# Altium schematic sheet main.schdoc
size A2; Organization: Protel International P/L; Address1: L3, 12a Rodborough Rd; Address2: Frenchs Forest; Address3: NSW; Address4: Australia 2086
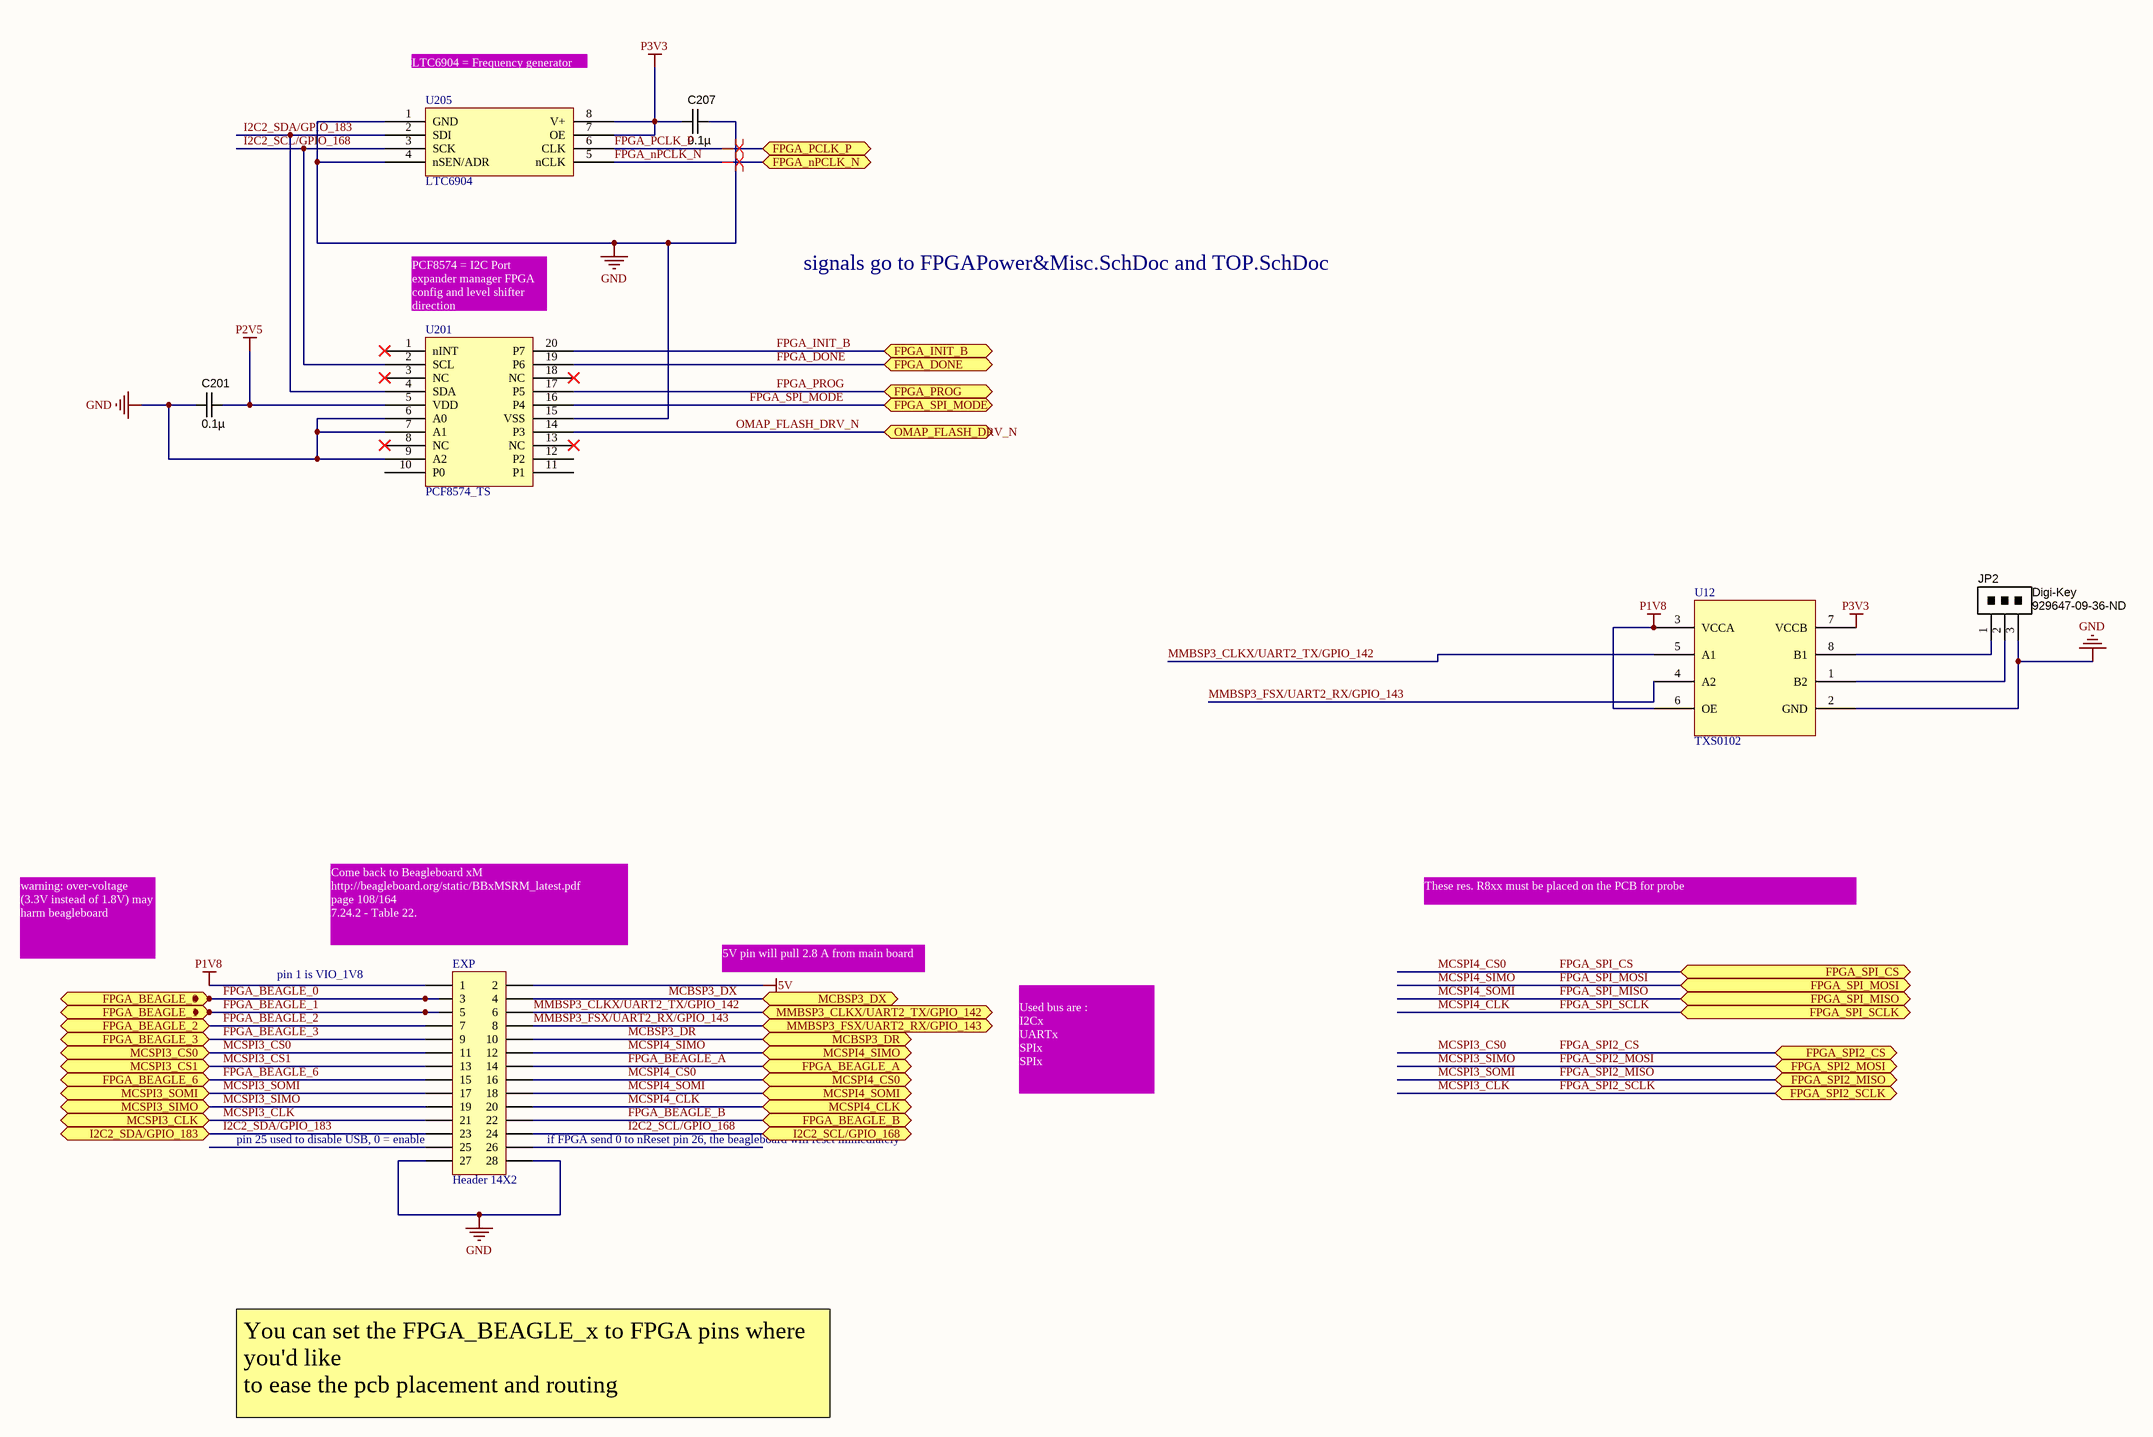
[diagram p0: main.schdoc]

## Parts
C201  0.1µ  [CAPC1005X55N]
C207  0.1µ  [CAPC1005X55N]
EXP  Header 14X2  [HDR2X14]
JP2  Supplier 1: Digi-Key  Supplier Part Number 1: 929647-09-36-ND  [1x3POS_HEADER]  (hidden comment: R T G)
U12  TXS0102  [TSSOP65P400X110-8N]
U201  PCF8574_TS  [TSSOP65P640X120-20N]
U205  LTC6904  [SOP65P490X109-8N]

## Ports
FPGA_BEAGLE_0 (bidir), FPGA_BEAGLE_1 (bidir), FPGA_BEAGLE_2 (bidir), FPGA_BEAGLE_3 (bidir), FPGA_BEAGLE_6 (bidir), FPGA_BEAGLE_A (bidir), FPGA_BEAGLE_B (bidir), FPGA_DONE (bidir), FPGA_INIT_B (bidir), FPGA_nPCLK_N (bidir), FPGA_PCLK_P (bidir), FPGA_PROG (bidir), FPGA_SPI2_CS (bidir), FPGA_SPI2_MISO (bidir), FPGA_SPI2_MOSI (bidir), FPGA_SPI2_SCLK (bidir), FPGA_SPI_CS (bidir), FPGA_SPI_MISO (bidir), FPGA_SPI_MODE (bidir), FPGA_SPI_MOSI (bidir), FPGA_SPI_SCLK (bidir), I2C2_SCL/GPIO_168 (bidir), I2C2_SDA/GPIO_183 (bidir), MCBSP3_DR (bidir), MCBSP3_DX (bidir), MCSPI3_CLK (bidir), MCSPI3_CS0 (bidir), MCSPI3_CS1 (bidir), MCSPI3_SIMO (bidir), MCSPI3_SOMI (bidir), MCSPI4_CLK (bidir), MCSPI4_CS0 (bidir), MCSPI4_SIMO (bidir), MCSPI4_SOMI (bidir), MMBSP3_CLKX/UART2_TX/GPIO_142 (bidir), MMBSP3_FSX/UART2_RX/GPIO_143 (bidir), OMAP_FLASH_DRV_N (bidir)

## Nets
5V: EXP.2
GND: C201.2 C207.1 EXP.27 EXP.28 JP2.3 U12.2(GND) U201.6(A0) U201.7(A1) U201.9(A2) U201.15(VSS) U205.1(GND) U205.4(nSEN/ADR)
P1V8: EXP.1 U12.3(VCCA) U12.6(OE)
P2V5: C201.1 U201.5(VDD)
P3V3: C207.2 U12.7(VCCB) U205.7(OE) U205.8(V+)
FPGA_BEAGLE_0: EXP.3 ; port FPGA_BEAGLE_0
FPGA_BEAGLE_1: EXP.5 ; port FPGA_BEAGLE_1
FPGA_BEAGLE_2: EXP.7 ; port FPGA_BEAGLE_2
FPGA_BEAGLE_3: EXP.9 ; port FPGA_BEAGLE_3
FPGA_BEAGLE_6: EXP.15 ; port FPGA_BEAGLE_6
FPGA_BEAGLE_A: EXP.14 ; port FPGA_BEAGLE_A
FPGA_BEAGLE_B: EXP.22 ; port FPGA_BEAGLE_B
FPGA_DONE: U201.19(P6) ; port FPGA_DONE
FPGA_INIT_B: U201.20(P7) ; port FPGA_INIT_B
FPGA_nPCLK_N: U205.5(nCLK) ; port FPGA_nPCLK_N
FPGA_PCLK_P: U205.6(CLK) ; port FPGA_PCLK_P
FPGA_PROG: U201.17(P5) ; port FPGA_PROG
FPGA_SPI2_CS: EXP.11 ; port MCSPI3_CS0, port FPGA_SPI2_CS  [also labelled MCSPI3_CS0]
FPGA_SPI2_MISO: EXP.17 ; port MCSPI3_SOMI, port FPGA_SPI2_MISO  [also labelled MCSPI3_SOMI]
FPGA_SPI2_MOSI: EXP.19 ; port MCSPI3_SIMO, port FPGA_SPI2_MOSI  [also labelled MCSPI3_SIMO]
FPGA_SPI2_SCLK: EXP.21 ; port MCSPI3_CLK, port FPGA_SPI2_SCLK  [also labelled MCSPI3_CLK]
FPGA_SPI_CS: EXP.16 ; port MCSPI4_CS0, port FPGA_SPI_CS  [also labelled MCSPI4_CS0]
FPGA_SPI_MISO: EXP.18 ; port MCSPI4_SOMI, port FPGA_SPI_MISO  [also labelled MCSPI4_SOMI]
FPGA_SPI_MODE: U201.16(P4) ; port FPGA_SPI_MODE
FPGA_SPI_MOSI: EXP.12 ; port MCSPI4_SIMO, port FPGA_SPI_MOSI  [also labelled MCSPI4_SIMO]
FPGA_SPI_SCLK: EXP.20 ; port MCSPI4_CLK, port FPGA_SPI_SCLK  [also labelled MCSPI4_CLK]
I2C2_SCL/GPIO_168: EXP.24 U201.2(SCL) U205.3(SCK) ; port I2C2_SCL/GPIO_168
I2C2_SDA/GPIO_183: EXP.23 U201.4(SDA) U205.2(SDI) ; port I2C2_SDA/GPIO_183
MCBSP3_DR: EXP.10 ; port MCBSP3_DR
MCBSP3_DX: EXP.4 ; port MCBSP3_DX
MCSPI3_CS1: EXP.13 ; port MCSPI3_CS1
MMBSP3_CLKX/UART2_TX/GPIO_142: EXP.6 U12.5(A1) ; port MMBSP3_CLKX/UART2_TX/GPIO_142
MMBSP3_FSX/UART2_RX/GPIO_143: EXP.8 U12.4(A2) ; port MMBSP3_FSX/UART2_RX/GPIO_143
OMAP_FLASH_DRV_N: U201.14(P3) ; port OMAP_FLASH_DRV_N
NetJP2_1: JP2.1 U12.8(B1)
NetJP2_2: JP2.2 U12.1(B2)

Not connected (* = marked no-connect by the designer): EXP 25 26; U201 1(nINT)* 3(NC)* 8(NC)* 10(P0) 11(P1) 12(P2) 13(NC)* 18(NC)*

## Layout directives
differential pair: FPGA_nPCLK_N, FPGA_PCLK_P

## Notes on the sheet
- LTC6904 = Frequency generator
- (near U201) PCF8574 = I2C Port expander manager FPGA config and level shifter direction
- signals go to FPGAPower&Misc.SchDoc and TOP.SchDoc
- These res. R8xx must be placed on the PCB for probe
- warning: over-voltage (3.3V instead of 1.8V) may harm beagleboard
- pin 1 is VIO_1V8
- (near EXP) Come back to Beagleboard xM
  http://beagleboard.org/static/BBxMSRM_latest.pdf
  page 108/164
  7.24.2 - Table 22.
- 5V pin will pull 2.8 A from main board
- Used bus are :
  I2Cx
  UARTx
  SPIx
  SPIx
- (near EXP) pin 25 used to disable USB, 0 = enable
- (near EXP) if FPGA send 0 to nReset pin 26, the beagleboard will reset immediately
- You can set the FPGA_BEAGLE_x to FPGA pins where you'd like
  to ease the pcb placement and routing
- Title
- Size:
- Date:
- File:
- A1
- Number:
- Time:
- Revision:
- Sheet
- of

## Library data of the parts
C201 C207 = CAPC_1u_0402_X5R_6V3_10%: Capacitor SMD Cer 1uF 10% 16V X5R 0402; Manufacturer 1: AVX Corporation; Manufacturer Part Number 1: 04026D105KAT2A; Ratings: 6.3V; X5R; SCDType: spec; Tolerance: ±10%; Operating Temperature: -55°C ~ 125°C; Package / Case: 0402 (1005 Metric); Size / Dimension: 0.039" L x 0.020" W (1.00mm x 0.50mm); Supplier 1: Digi-Key; Supplier Part Number 1: 478-2583-1-ND; RoHS 1: RoHS Compliant; ComponentLink1URL: http://www.avx.com/docs/Catalogs/cx5r.pdf; ComponentLink1Description: http://www.avx.com/docs/Catalogs/cx5r.pdf; Supplier 2: Digi-Key; Supplier Part Number 2: 311-1438-1-ND; Manufacturer 2: Yageo; Manufacturer Part Number 2: CC0402KRX5R5BB105; RoHS 2: RoHS Compliant; ComponentLink2URL: http://www.yageo.com/documents/recent/UPY-GPHC_X5R_4V-to-50V_12.pdf; ComponentLink2Description: http://www.yageo.com/documents/recent/UPY-GPHC_X5R_4V-to-50V_12.pdf; Supplier 3: Digi-Key; Supplier Part Number 3: 1276-1010-1-ND; Manufacturer 3: Samsung Electro-Mechanics America, Inc; Manufacturer Part Number 3: CL05A105KQ5NNNC; RoHS 3: RoHS Compliant; ComponentLink3URL: http://www.samsungsem.com/servlet/FileDownload?path=productsearch&sname=CL05A105KQ5NNNC.pdf&oname=CL05A105KQ5NNNC.pdf; ComponentLink3Description: http://www.samsungsem.com/servlet/FileDownload?path=productsearch&sname=CL05A105KQ5NNNC.pdf&oname=CL05A105KQ5NNNC.pdf; Supplier 4: Digi-Key; Supplier Part Number 4: 445-4998-1-ND; Manufacturer 4: TDK Corporation; Manufacturer Part Number 4: C1005X5R0J105K050BB; RoHS 4: RoHS Compliant; ComponentLink4URL: http://product.tdk.com/capacitor/mlcc/en/documents/mlcc_commercial_general_en.pdf; ComponentLink4Description: http://product.tdk.com/capacitor/mlcc/en/documents/mlcc_commercial_general_en.pdf; Supplier 5: Digi-Key; Supplier Part Number 5: 490-1320-1-ND; Manufacturer 5: Murata Electronics North America; Manufacturer Part Number 5: GRM155R60J105KE19D; RoHS 5: RoHS Compliant; ComponentLink5URL: http://www.murata.com/products/catalog/pdf/c02e.pdf; ComponentLink5Description: http://www.murata.com/products/catalog/pdf/c02e.pdf; Value: 0.1µ
EXP = Header 14X2: Header, 14-Pin, Dual row; LatestRevisionDate: 17-Jul-2002; LatestRevisionNote: Re-released for DXP Platform.; Publisher: Altium Limited
JP2 = CONN_HEADER_1x3P_0.100in: Pin Header, THT, Single-row, 2.54mm pitch; Manufacturer 1: 3M; Manufacturer Part Number 1: 929647-09-36-I; Pitch: 0.100" (2.54mm); Value: Single-row, 3 positions; QtyOverride: 0.1; SCDType: undef; Category: Connectors; Mounting Type: Through Hole; Terminal Block Type: Header, Male Pins, Single; Package / Case: Pin header; 2.54mm pitch